# Altium schematic sheet QUTMS-TSAL-LEDs.SchDoc
size A4; SheetNumber: 1; SheetTotal: 3
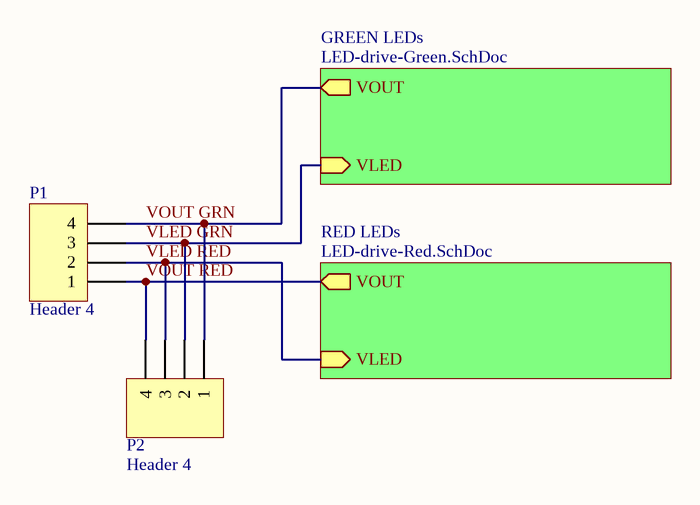
[diagram p0: QUTMS-TSAL-LEDs.SchDoc]

## Parts
P1  Header 4  [HDR1X4]
P2  Header 4  [HDR1X4]

## Sub-sheets
GREEN LEDs = LED-drive-Green.SchDoc: VLED (in), VOUT (out)
RED LEDs = LED-drive-Red.SchDoc: VLED (in), VOUT (out)

## Nets
VLED GRN: P1.3 P2.2 ; sheet GREEN LEDs/VLED
VLED RED: P1.2 P2.3 ; sheet RED LEDs/VLED
VOUT GRN: P1.4 P2.1 ; sheet GREEN LEDs/VOUT
VOUT RED: P1.1 P2.4 ; sheet RED LEDs/VOUT

## Library data of the parts
P1 P2 = Header 4: Header, 4-Pin; LatestRevisionDate: 17-Jul-2002; LatestRevisionNote: Re-released for DXP Platform.; Publisher: Altium Limited